# EAGLE design light (EAGLE 9.6.2)
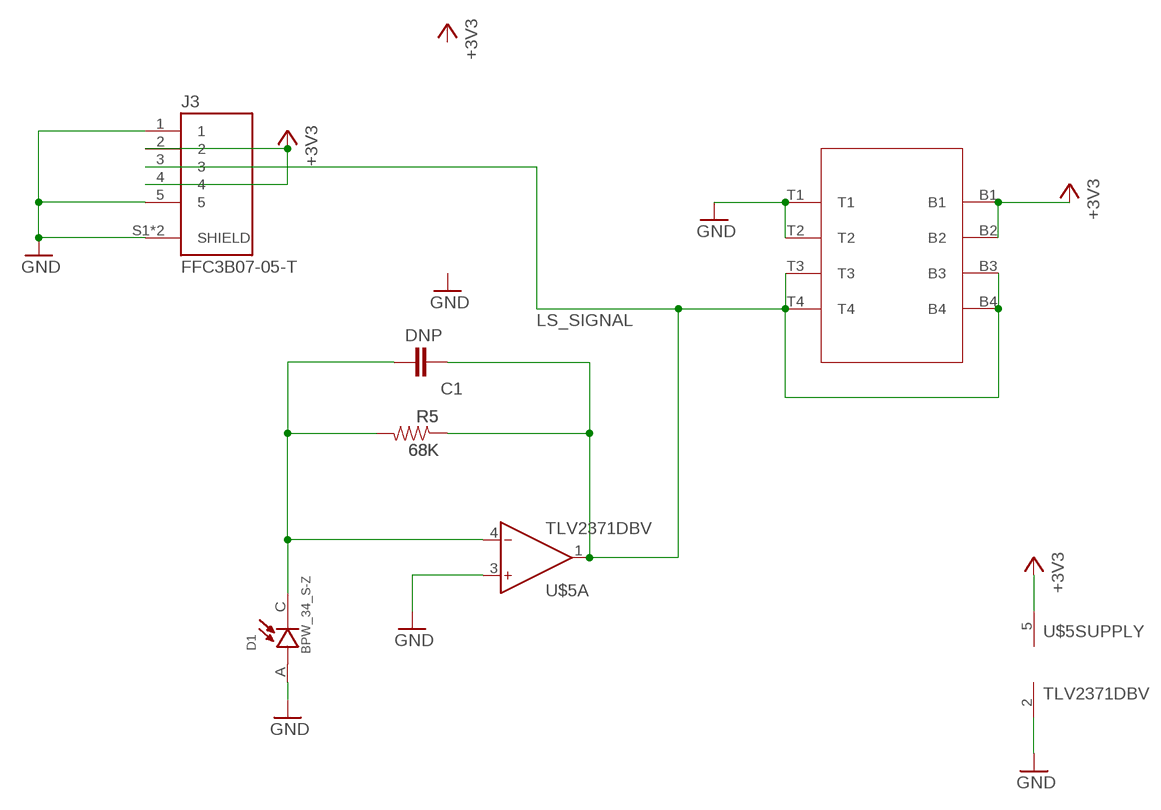
[diagram p0: schematic, sheet 1]

## Parts
C1  DNP  CAP0805  [0805]
D1  BPW_34_S-Z  [DIO_BPW_34_S-Z]
J3  FFC3B07-05-T  [GCT_FFC3B07-05-T]
R5  68K  RESISTOR0805-RES  [0805]
U$1  LS_VERT  [LS_VERT]
U$5  TLV2371DBV  [SOT23-5L]

## Nets
+3V3: J3.2 J3.4 U$1.B1 U$1.B2 U$5.5(SUPPLY:V+)
GND: D1.A J3.1 J3.5 J3.S1(SHIELD) J3.S2(SHIELD) U$1.T1 U$1.T2 U$5.2(SUPPLY:V-) U$5.3(A:IN+)
LS_SIGNAL: C1.1 J3.3 R5.1 U$1.B3 U$1.B4 U$1.T3 U$1.T4 U$5.1(A:OUT)
N$2: C1.2 D1.C R5.2 U$5.4(A:IN-)

## Library data of the parts
C1 = clock:CAP: Capacitor Standard 0603 ceramic capacitor, and 0.1" leaded capacitor.
D1 = BPW_34_S-Z:BPW_34_S-Z: Check availability <https://pricing.snapeda.com/parts/BPW%2034%20S-Z/OSRAM%20Opto/view-part?ref=eda>; AVAILABILITY: In Stock; CHECK_PRICES: https://www.snapeda.com/parts/BPW%2034%20S-Z/OSRAM/view-part/?ref=eda; DESCRIPTION: Photodiode 850nm 20ns 120° 2-SMD, Gull Wing; MF: OSRAM Opto; MP: BPW 34 S-Z; PACKAGE: SMD-2 OSRAM Opto Semiconductors; PRICE: None; SNAPEDA_LINK: https://www.snapeda.com/parts/BPW%2034%20S-Z/OSRAM/view-part/?ref=snap
J3 = FFC3B07-05-T:FFC3B07-05-T: FPC 1.0mm Pitch, Side entry, Top contact, SMT, Height 2.5mm, Slide type Check availability <https://pricing.snapeda.com/parts/FFC3B07-05-T/Global%20Connector%20Technology/view-part?ref=eda>; AVAILABILITY: In Stock; CHECK_PRICES: https://www.snapeda.com/parts/FFC3B07-05-T/Global+Connector+Technology/view-part/?ref=eda; DESCRIPTION: 5 Position FFC, FPC Connector Contacts, Bottom 0.039 (1.00mm) Surface Mount, Right Angle; MF: Global Connector Technology; MP: FFC3B07-05-T; PACKAGE: None; PRICE: None; SNAPEDA_LINK: https://www.snapeda.com/parts/FFC3B07-05-T/Global+Connector+Technology/view-part/?ref=snap
R5 = joyAnalog:RESISTOR: Resistor Basic schematic elements and footprints for 0603, 1206, and PTH resistors.
U$1 = apricot:LS_VERT
U$5 = texas-instruments:TLV2371: SINGLE 550 ?A/Ch 3MHz RAIL TO RAIL INPUT/OUTPUT OPERATIONAL AMPLIFIER

## Board
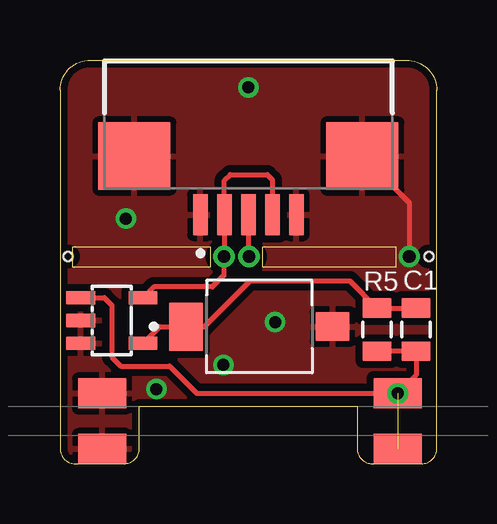
[diagram p1: board, top side]
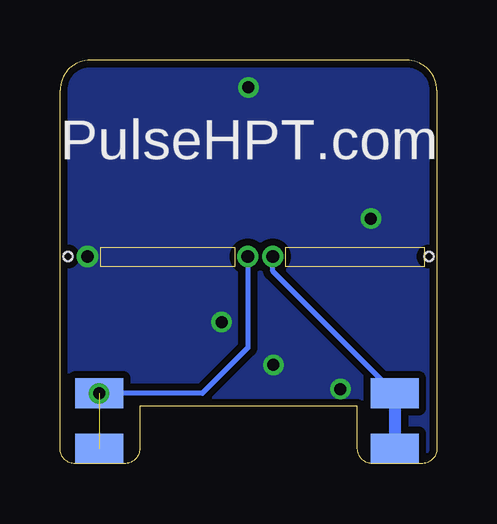
[diagram p2: board, bottom side, seen from below]

Size 15.7 x 16.82 mm. Coordinates in mm from the lower left corner, seen from the top.
Outline: 1.27,16.82 14.43,16.82 arc-90 15.7,15.55 15.7,0.64 arc-90 15.06,0 13.02,0 arc-90 12.38,0.64 12.38,2.4 3.31,2.4 3.31,0.64 arc-90 2.67,0 0.64,0 arc-90 0,0.64 0,15.55 arc-90 1.27,16.82
Copper layers (1*16): Top 0.035mm / dielectric 1.5mm / Bottom 0.035mm
Design rules "deku_2layer_6mil": minimum track width 6mil, minimum drill 15mil, track to track 6mil, track to pad 6mil, pad to pad 6mil, via to via 6mil, smd to smd 6mil, copper to edge 10mil, drill to drill 6mil, minimum pad ring 7mil, minimum via ring 7mil, stop-mask expansion 4mil, vias tented up to drill 25mil, thermal gap 10mil
Holes 0.38 mm at 15.37,8.64 0.33,8.64
Milling: area 0.5,8.2 to 6.3,9; area 8.4,8.2 to 14,9

### Footprints (pad centres in the part's own frame; a part is rotated, then mirrored left to right if it is on the bottom)
0805 = smd 0.8 x 1.2: 1 -0.9,0; 2 0.9,0
DIO_BPW_34_S-Z = smd 1.4 x 1.2: A -3.05,0 | smd 1.4 x 2: C 3.05,0
GCT_FFC3B07-05-T = smd 0.6 x 1.7: 1 2,2.45; 2 1,2.45; 3 0,2.45; 4 -1,2.45; 5 -2,2.45 | smd 3 x 2.8: S1 4.75,0; S2 -4.75,0
LS_VERT = smd 1.25 x 2 bottom: B1 -0.557,6.096; B2 1.759,6.096; B3 -0.557,-6.223; B4 1.759,-6.223 | smd 1.25 x 2: T1 -0.557,6.096; T2 1.759,6.096; T3 -0.557,-6.223; T4 1.759,-6.223
SOT23-5L = smd 0.55 x 1.2: 1 -0.95,-1.3; 2 0,-1.3; 3 0.95,-1.3; 4 0.95,1.3; 5 -0.95,1.3

### Placement (x,y rotation side)
C1  14.83,5.59 90 top
D1  8.31,5.71 180 top
J3  7.85,12.82 180 top
R5  13.21,5.59 90 top
U$1  7.85,1.17 90 top
U$5  2.16,5.97 270 top

### Tracks (layer width: path | path; a pad name or v marks a point on that pad's centre or on a via)
+3V3  (via drill 0.53)
  Top 0.203: J3.4 8.85,11.83 8.64,12.05 7.09,12.05 6.85,11.81 J3.2 6.85,8.65 v6.83,8.64 6.83,7.85 6.35,7.37 3.91,7.37 U$5.5
  Bottom 0.203: v6.83,8.64 6.83,8.01 U$1.B2
  Bottom 0.508: U$1.B2 U$1.B1
GND  (via drill 0.5, 0.53)
  Top 0.203: v14.55,8.64 14.55,10.87 J3.S2
  other vias: 7.85,15.68 4.01,3.11 8.97,5.9 6.81,4.12 2.74,10.22
  pour Top (isolate 0.305): -37.85,30 -37.85,-38 54.64,-38 54.64,30
  pour Bottom (isolate 0.305): -36,26 52,26 52,-34 -36,-34
LS_SIGNAL  (via drill 0.5, 0.53)  (2 unrouted)
  Top 0.203: J3.3 7.85,8.66 v7.87,8.64 | R5.1 C1.1 14.83,3.69 U$1.T4 5.7,2.93 4.57,4.06 2.54,4.06 2.16,4.45 2.16,6.6 1.84,6.92 U$5.1
  Bottom 0.203: v7.87,8.64 7.87,4.83 9.77,2.93 U$1.T4
  other vias: 14.07,2.93
N$2
  Top 0.203: C1.2 R5.2 12.08,7.62 7.92,7.62 6.02,5.71 D1.C 4.16,5.71 U$5.4

### Text on the board
bNames: PulseHPT.com
tDocu: PCB THICKNESS 1mm!!!!